# Altium project PCB_Project1.PrjPCB
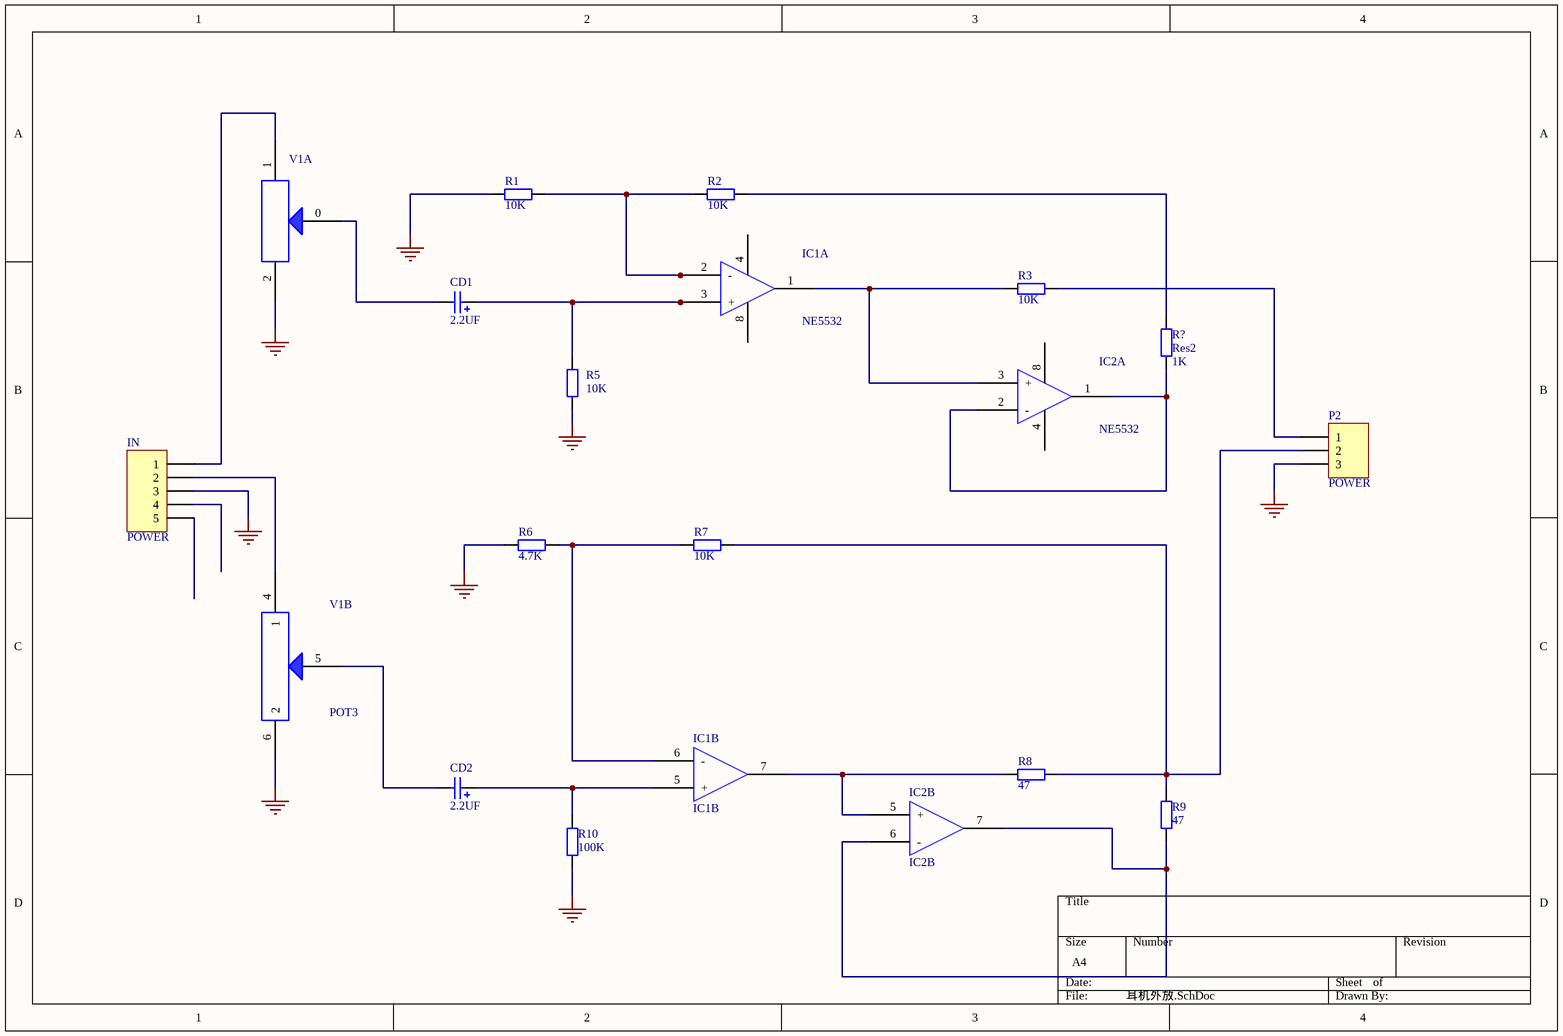
[diagram p0: 耳机外放.SchDoc]
1 sheet, 20 parts. Net scope: global (net labels, ports and power ports of the same name join across sheets).
Board file: 耳机外放.PcbDoc

## Sheet 耳机外放.SchDoc
size A4

### Parts
*  V1A
CD1  2.2UF  [POLAR0.8]
CD2  2.2UF  [POLAR0.8]
IC1A  NE5532
IC1B  IC1B
IC2A  NE5532
IC2B  IC2B
IN  POWER  [HDR1X5]
P2  POWER  [HDR1X3]
R1  10K  [AXIAL-0.4]
R2  10K  [AXIAL-0.4]
R3  10K  [AXIAL-0.4]
R5  value 10K  [AXIAL-0.4]  (hidden comment: Res2)
R6  4.7K  [AXIAL-0.4]
R7  10K  [AXIAL-0.4]
R8  47  [AXIAL-0.4]
R9  47  [AXIAL-0.4]
R10  100K  [AXIAL-0.4]
R?  Res2  value 1K  [AXIAL-0.4]
V1B  POT3

### Nets
GND: *.2 IN.3 P2.3 R1.1 R5.1 R6.1 R10.2 V1B.6(2)
Net*_0: *.0 CD1.2
Net*_1: *.1 IN.1
NetCD1_1: CD1.1 IC1A.3(+) R5.2
NetCD2_1: CD2.1 IC1B.5(+) R10.1
NetCD2_2: CD2.2 V1B.5
NetIC1A_1: IC1A.1 IC2A.3(+) R3.1
NetIC1A_2: IC1A.2(-) R1.2 R2.1
NetIC1B_6: IC1B.6(-) R6.2 R7.1
NetIC1B_7: IC1B.7 IC2B.5(+) R8.2
NetIC2A_1: IC2A.1 IC2A.2(-) R?.1
NetIC2B_6: IC2B.6(-) IC2B.7 R9.1
NetIN_2: IN.2 V1B.4(1)
NetP2_1: P2.1 R3.2
NetP2_2: P2.2 R7.2 R8.1 R9.2
NetR2_2: R2.2 R?.2

Not connected (* = marked no-connect by the designer): IC1A 4(6) 8; IC2A 4 8; IN 4 5

### Library data of the parts
* = Component_1
CD1 CD2 = Cap Pol2: Polarized Capacitor (Axial); Value: 100pF; Published: 8-Jun-2000; LatestRevisionDate: 17-Jul-2002; LatestRevisionNote: Re-released for DXP Platform.; Publisher: Altium Limited
IC1A = U1
IC2A = IC2A
IN = Header 5: Header, 5-Pin; LatestRevisionDate: 17-Jul-2002; LatestRevisionNote: Re-released for DXP Platform.; Publisher: Altium Limited
P2 = Header 3: Header, 3-Pin; LatestRevisionDate: 17-Jul-2002; LatestRevisionNote: Re-released for DXP Platform.; Publisher: Altium Limited
R1 R2 R5 R7 R10 R? = Res2: Resistor; Published: 8-Jun-2000; LatestRevisionDate: 17-Jul-2002; LatestRevisionNote: Re-released for DXP Platform.; Publisher: Altium Limited
  R2 R7: Value: 10K
R3 = Res2: Resistor; Value: 1K; Published: 8-Jun-2000; LatestRevisionDate: 17-Jul-2002; LatestRevisionNote: Re-released for DXP Platform.; Publisher: Altium Limited
R6 R8 R9 = Res2: Resistor; Value: 10K; Published: 8-Jun-2000; LatestRevisionDate: 17-Jul-2002; LatestRevisionNote: Re-released for DXP Platform.; Publisher: Altium Limited
V1B = V1B